# EAGLE design untitled (EAGLE 6.6.0)
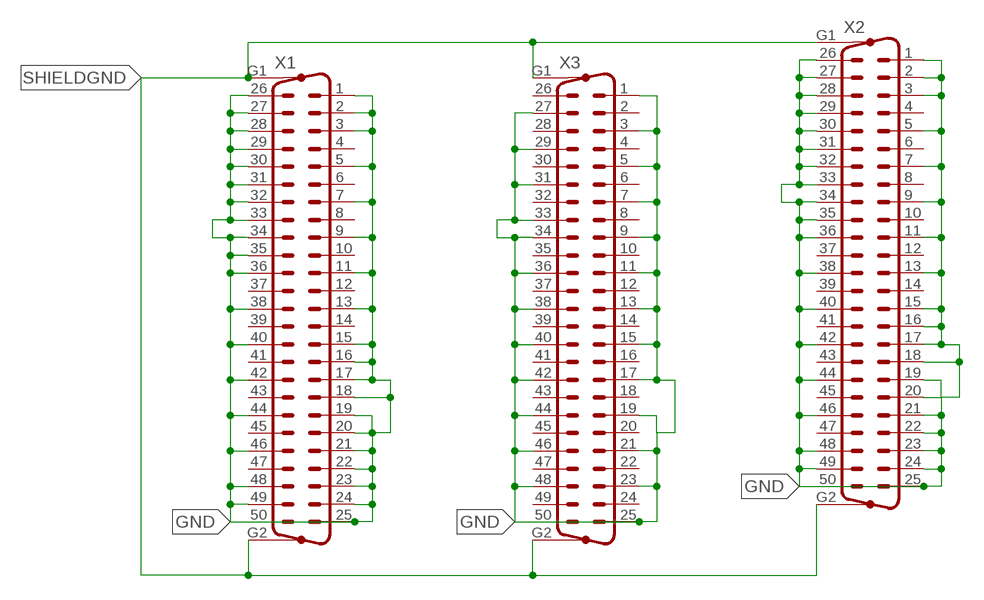
[diagram p0: schematic, sheet 1]

## Parts
X1  M50VP  [M50VP]
X2  M50VP  [M50VP]
X3  M50VP  [M50VP]

## Nets
GND: X1.1 X1.2 X1.3 X1.5 X1.7 X1.9 X1.11 X1.13 X1.15 X1.16 X1.17 X1.18 X1.19 X1.20 X1.21 X1.22 X1.23 X1.24 X1.25 X1.26 X1.27 X1.28 X1.29 X1.30 X1.31 X1.32 X1.33 X1.34 X1.35 X1.36 X1.38 X1.40 X1.42 X1.44 X1.46 X1.48 X1.49 X1.50 X2.1 X2.2 X2.3 X2.5 X2.7 X2.9 X2.11 X2.13 X2.15 X2.16 X2.17 X2.18 X2.19 X2.20 X2.21 X2.22 X2.23 X2.24 X2.25 X2.26 X2.27 X2.28 X2.29 X2.30 X2.31 X2.32 X2.33 X2.34 X2.35 X2.36 X2.38 X2.40 X2.42 X2.44 X2.46 X2.48 X2.49 X2.50 X3.1 X3.3 X3.5 X3.7 X3.9 X3.11 X3.13 X3.15 X3.17 X3.19 X3.21 X3.23 X3.25 X3.27 X3.29 X3.31 X3.33 X3.34 X3.36 X3.38 X3.40 X3.42 X3.44 X3.46 X3.48 X3.50
SHIELDGND: X1.G1 X1.G2 X2.G1 X2.G2 X3.G1 X3.G2
Unconnected: X1.4 X1.6 X1.8 X1.10 X1.12 X1.14 X1.37 X1.39 X1.41 X1.43 X1.45 X1.47 X2.4 X2.6 X2.8 X2.10 X2.12 X2.14 X2.37 X2.39 X2.41 X2.43 X2.45 X2.47 X3.2 X3.4 X3.6 X3.8 X3.10 X3.12 X3.14 X3.16 X3.18 X3.20 X3.22 X3.24 X3.26 X3.28 X3.30 X3.32 X3.35 X3.37 X3.39 X3.41 X3.43 X3.45 X3.47 X3.49

## Library data of the parts
X1-X3 = con-subd:M50VP: SUB-D; OC_FARNELL: unknown; OC_NEWARK: unknown

## Board
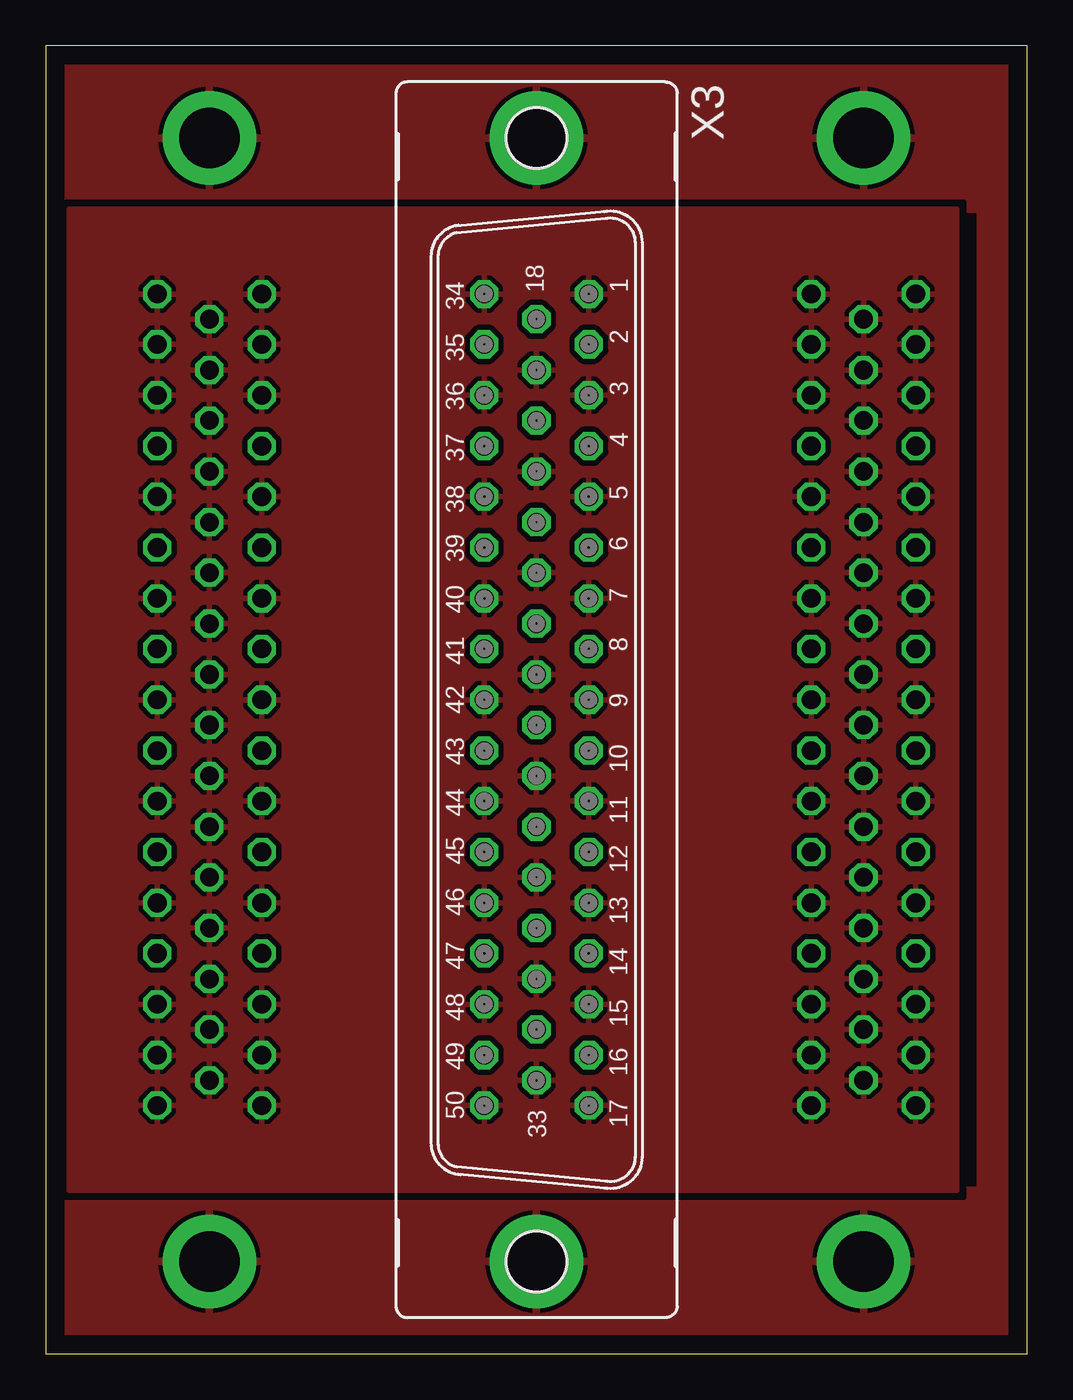
[diagram p1: board, top side]
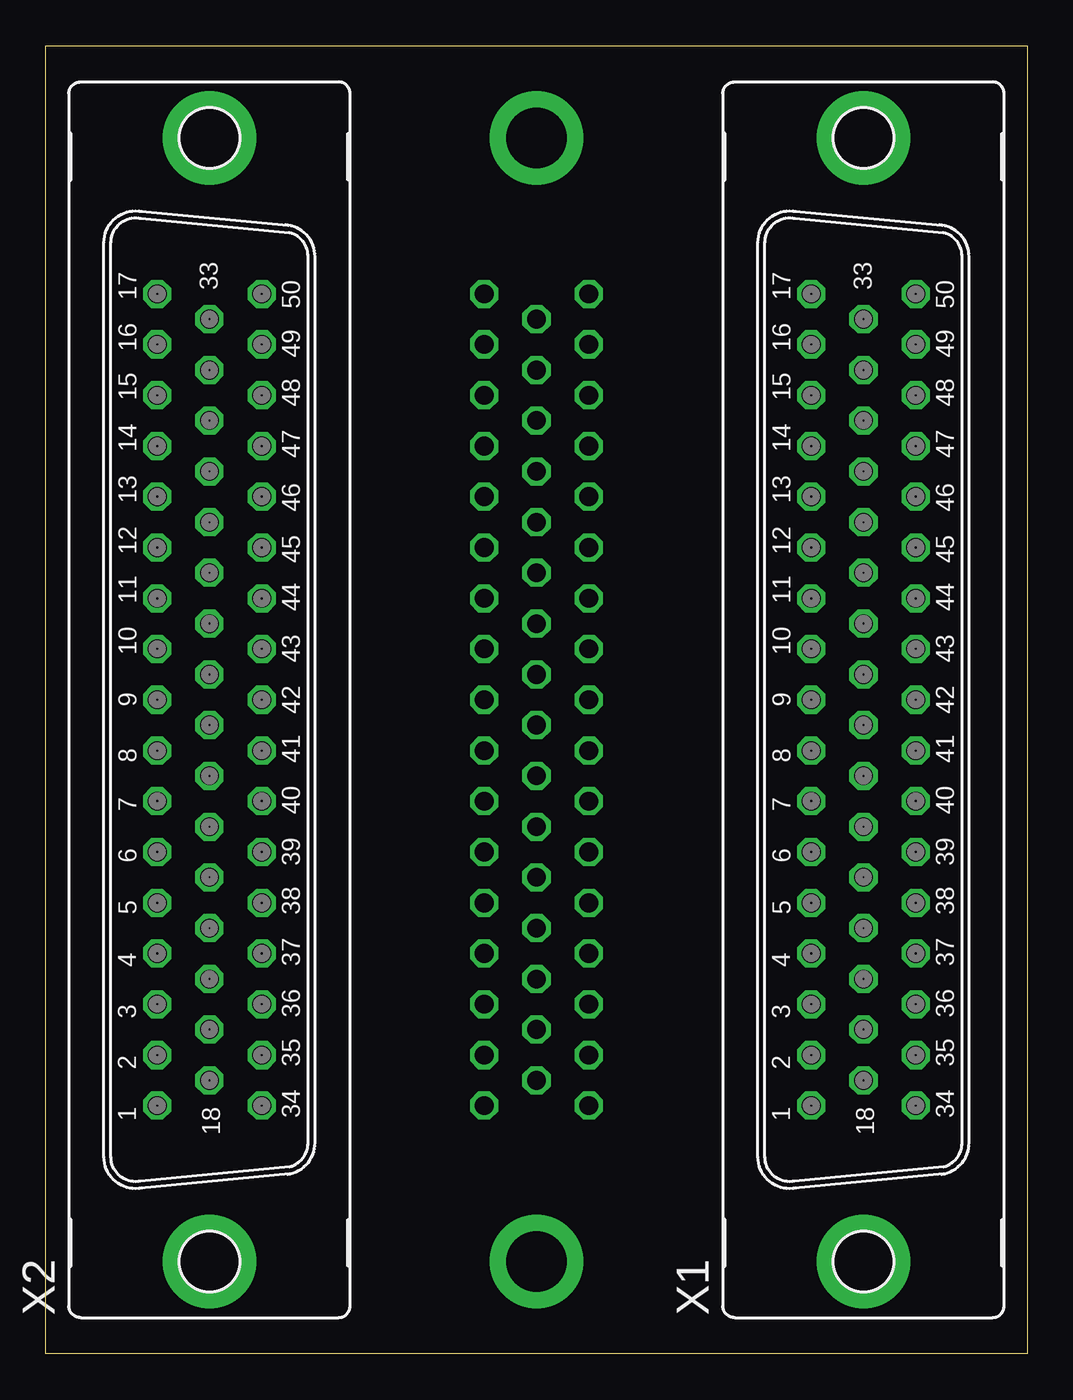
[diagram p2: board, bottom side, seen from below]

Size 53.34 x 71.12 mm. Coordinates in mm from the lower left corner, seen from the top.
Outline: 0,0 53.34,0 53.34,71.12 0,71.12 0,0
Copper layers (1*16): Top 0.035mm / dielectric 1.5mm / Bottom 0.035mm
Design rules "default": minimum track width 10mil, minimum drill 24mil, track to track 8mil, track to pad 8mil, pad to pad 8mil, via to via 8mil, smd to smd 8mil, copper to edge 40mil, drill to drill 8mil, minimum pad ring 10mil, minimum via ring 8mil, stop-mask expansion 4mil, vias tented up to drill 0mil, thermal gap 10mil

### Footprints (pad centres in the part's own frame; a part is rotated, then mirrored left to right if it is on the bottom)
M50VP = drill 1.016 octagon: 1 -22.073,2.845; 2 -19.329,2.845; 3 -16.561,2.845; 4 -13.792,2.845; 5 -11.049,2.845; 6 -8.28,2.845; 7 -5.512,2.845; 8 -2.769,2.845; 9 0,2.845; 10 2.769,2.845; 11 5.512,2.845; 12 8.28,2.845; 13 11.049,2.845; 14 13.792,2.845; 15 16.561,2.845; 16 19.329,2.845; 17 22.073,2.845; 18 -20.701,0; 19 -17.932,0; 20 -15.189,0; 21 -12.421,0; 22 -9.652,0; 23 -6.909,0; 24 -4.14,0; 25 -1.372,0; 26 1.372,0; 27 4.14,0; 28 6.909,0; 29 9.652,0; 30 12.421,0; 31 15.189,0; 32 17.932,0; 33 20.701,0; 34 -22.073,-2.845; 35 -19.329,-2.845; 36 -16.561,-2.845; 37 -13.792,-2.845; 38 -11.049,-2.845; 39 -8.28,-2.845; 40 -5.512,-2.845; 41 -2.769,-2.845; 42 0,-2.845; 43 2.769,-2.845; 44 5.512,-2.845; 45 8.28,-2.845; 46 11.049,-2.845; 47 13.792,-2.845; 48 16.561,-2.845; 49 19.329,-2.845; 50 22.073,-2.845 | drill 3.302 pad 5.08: G1 -30.556,0; G2 30.556,0

### Placement (x,y rotation side)
X1  8.89,35.56 90 bottom
X2  44.45,35.56 90 bottom
X3  26.67,35.56 270 top

### Tracks (layer width: path | path; a pad name or v marks a point on that pad's centre or on a via)
GND
  pour Top (isolate 0.305): 1.27,62.23 49.53,62.23 49.53,8.89 1.27,8.89
SHIELDGND
  pour Top (isolate 0.406, rank 4): -1.27,72.39 55.88,72.39 55.88,-3.81 -3.81,-3.81 -3.81,8.89 50.8,8.89 50.8,62.23 -2.54,62.23 -2.54,72.39